# Altium schematic sheet S06_Sensors.SchDoc
size A4
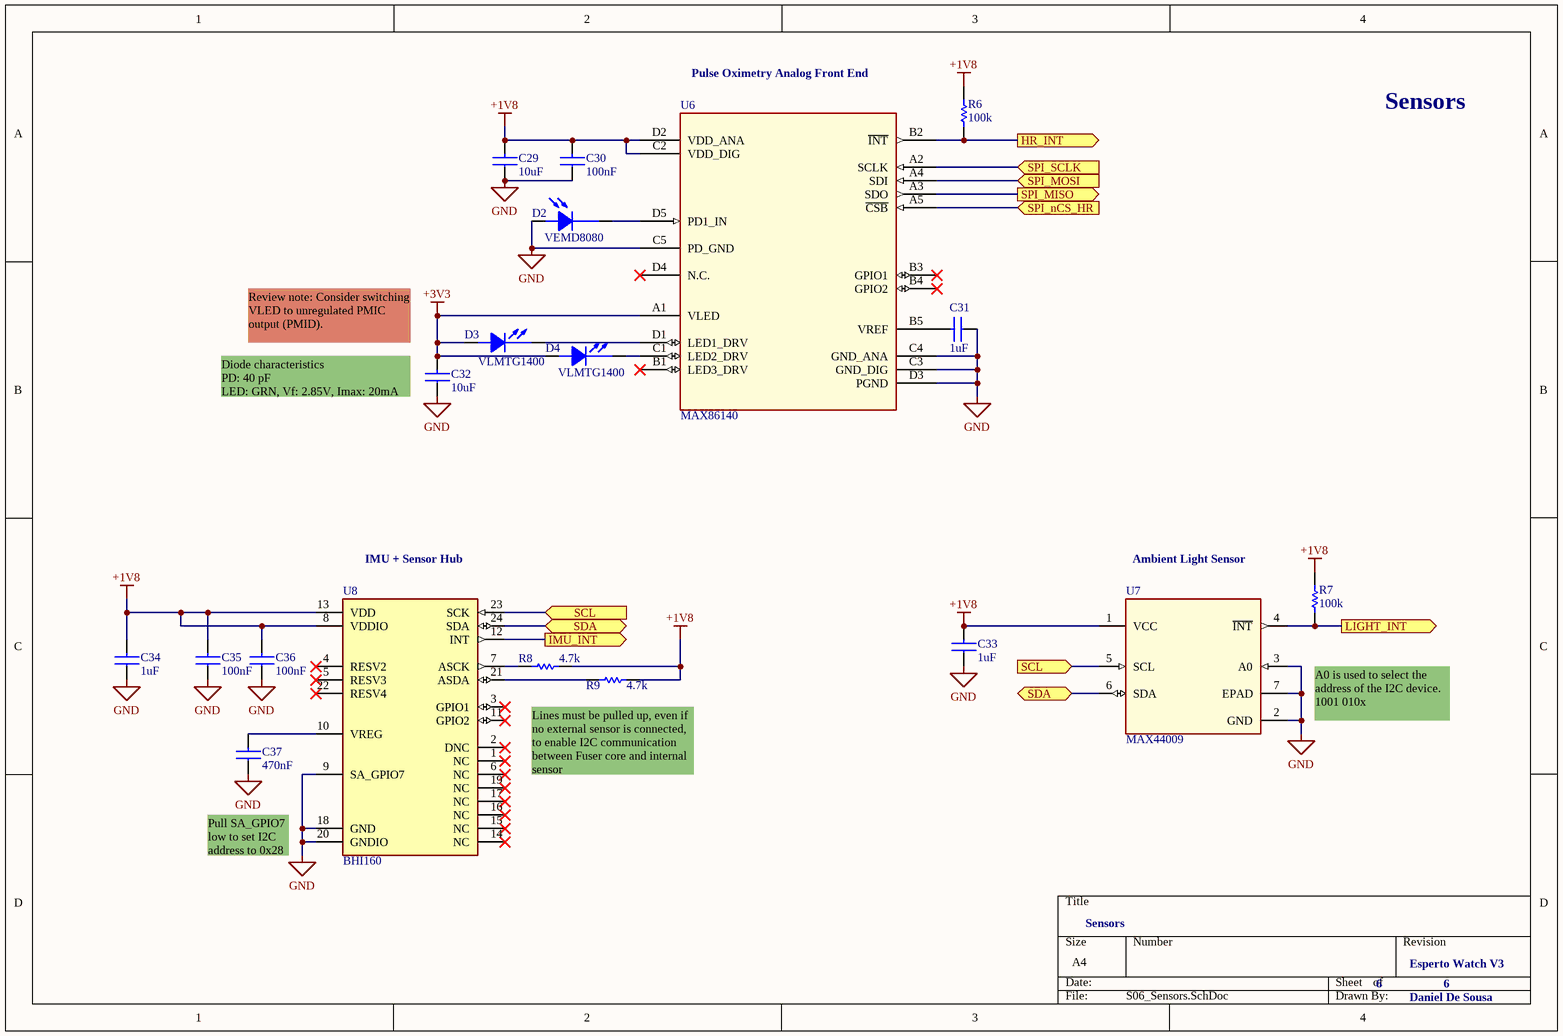
[diagram p0: S06_Sensors.SchDoc]

## Parts
C29  10uF  [CC_1005_0402_N]
C30  100nF  [CC_1005_0402_N]
C31  1uF  [CC_1005_0402_N]
C32  10uF  [CC_1005_0402_N]
C33  1uF  [CC_1005_0402_N]
C34  1uF  [CC_1005_0402_N]
C35  100nF  [CC_1005_0402_N]
C36  100nF  [CC_1005_0402_N]
C37  470nF  [CC_1005_0402_N]
D2  VEMD8080  [VEMD8080]
D3  VLMTG1400  [LED_GREEN_0603]
D4  VLMTG1400  [LED_GREEN_0603]
R6  100k  [RC_1005_0402_N]
R7  100k  [RC_1005_0402_N]
R8  4.7k  [RC_1005_0402_N]
R9  4.7k  [RC_1005_0402_N]
U6  MAX86140  [MAX86140]
U7  MAX44009  [MAX44009]
U8  BHI160  [BHI160]

## Ports
HR_INT (out), IMU_INT (out), LIGHT_INT (out), SCL (in), SDA (bidir), SPI_MISO (out), SPI_MOSI (in), SPI_nCS_HR (in), SPI_SCLK (in)

## Nets
+1V8: C29.2 C30.2 C33.2 C34.2 C35.2 C36.2 R6.2 R7.2 R8.1 R9.1 U6.C2(VDD_DIG) U6.D2(VDD_ANA) U7.1(VCC) U8.8(VDDIO) U8.13(VDD)
+3V3: C32.2 D3.A(Anode) D4.A(Anode) U6.A1(VLED)
GND: C29.1 C30.1 C31.1 C32.1 C33.1 C34.1 C35.1 C36.1 C37.1 D2.A(Anode) U6.C3(GND_DIG) U6.C4(GND_ANA) U6.C5(PD_GND) U6.D3(PGND) U7.2(GND) U7.3(A0) U7.7(EPAD) U8.9(SA_GPIO7) U8.18(GND) U8.20(GNDIO)
HR_INT: R6.1 U6.B2(~{INT}) ; port HR_INT
IMU_INT: U8.12(INT) ; port IMU_INT
LIGHT_INT: R7.1 U7.4(~{INT}) ; port LIGHT_INT
SCL: U7.5(SCL) U8.23(SCK) ; port SCL
SDA: U7.6(SDA) U8.24(SDA) ; port SDA
SPI_MISO: U6.A3(SDO) ; port SPI_MISO
SPI_MOSI: U6.A4(SDI) ; port SPI_MOSI
SPI_nCS_HR: U6.A5(~{CSB}) ; port SPI_nCS_HR
SPI_SCLK: U6.A2(SCLK) ; port SPI_SCLK
NetC31_2: C31.2 U6.B5(VREF)
NetC37_2: C37.2 U8.10(VREG)
NetD2_K: D2.K(Cathode) U6.D5(PD1_IN)
NetD3_K: D3.K(Cathode) U6.D1(LED1_DRV)
NetD4_K: D4.K(Cathode) U6.C1(LED2_DRV)
NetR8_2: R8.2 U8.7(ASCK)
NetR9_2: R9.2 U8.21(ASDA)

Not connected (* = marked no-connect by the designer): U6 B1(LED3_DRV)* B3(GPIO1)* B4(GPIO2)* D4(N.C.)*; U8 1(NC)* 2(DNC)* 3(GPIO1)* 4(RESV2)* 5(RESV3)* 6(NC)* 11(GPIO2)* 14(NC)* 15(NC)* 16(NC)* 17(NC)* 19(NC)* 22(RESV4)*

## Notes on the sheet
- Pulse Oximetry Analog Front End
- Sensors
- (near C32) Review note: Consider switching VLED to unregulated PMIC output (PMID).
- (near C32) Diode characteristics
  PD: 40 pF
  LED: GRN, Vf: 2.85V, Imax: 20mA
- (near U8) IMU + Sensor Hub
- Ambient Light Sensor
- A0 is used to select the address of the I2C device. 1001 010x
- Lines must be pulled up, even if no external sensor is connected, to enable I2C communication between Fuser core and internal sensor
- Pull SA_GPIO7 low to set I2C address to 0x28
- 6
- Esperto Watch V3
- Daniel De Sousa

## Library data of the parts
C29-C37 = Capacitor
  C29 C32: VALUE: 10uF
  C30 C35 C36: VALUE: 100nF
  C31 C33 C34: VALUE: 1uF
  C37: VALUE: 470nF
D2 = Photodiode
D3 D4 = LED: Single LED
R6-R9 = Resistor
  R6 R7: Value: 100k
  R8 R9: Value: 4.7k
U6 = MAX86140: Optical Pulse Oximeter and / Heart-Rate Sensor; Manufacturer_Part_Number: MAX86140ENP+; Built_By: EMA_UL_Team; Vendor: Maxim Integrated Products; Copyright: Copyright (C) 2018 Accelerated Designs. All rights reserved; RefDes: RefDes; Type: DEV; Value: Value
U7 = MAX44009: Ambient Light Sensor; Manufacturer_Part_Number: MAX44009EDT+T; Built_By: EMA_UL_Team; Vendor: Maxim Integrated Products; Copyright: Copyright (C) 2018 Accelerated Designs. All rights reserved; RefDes: RefDes; Type: DEV; Value: Value
U8 = BHI160: Ultra low-power sensor hub incl. integrated IMU; Part_Type: IC; Provided By: BOSCH; Package: *; ComponentLink1Description: *; ComponentLink1URL: *; Manufacturer_Part_Number: BHI160